# EAGLE schematic jphy_v1 (EAGLE 6.0)
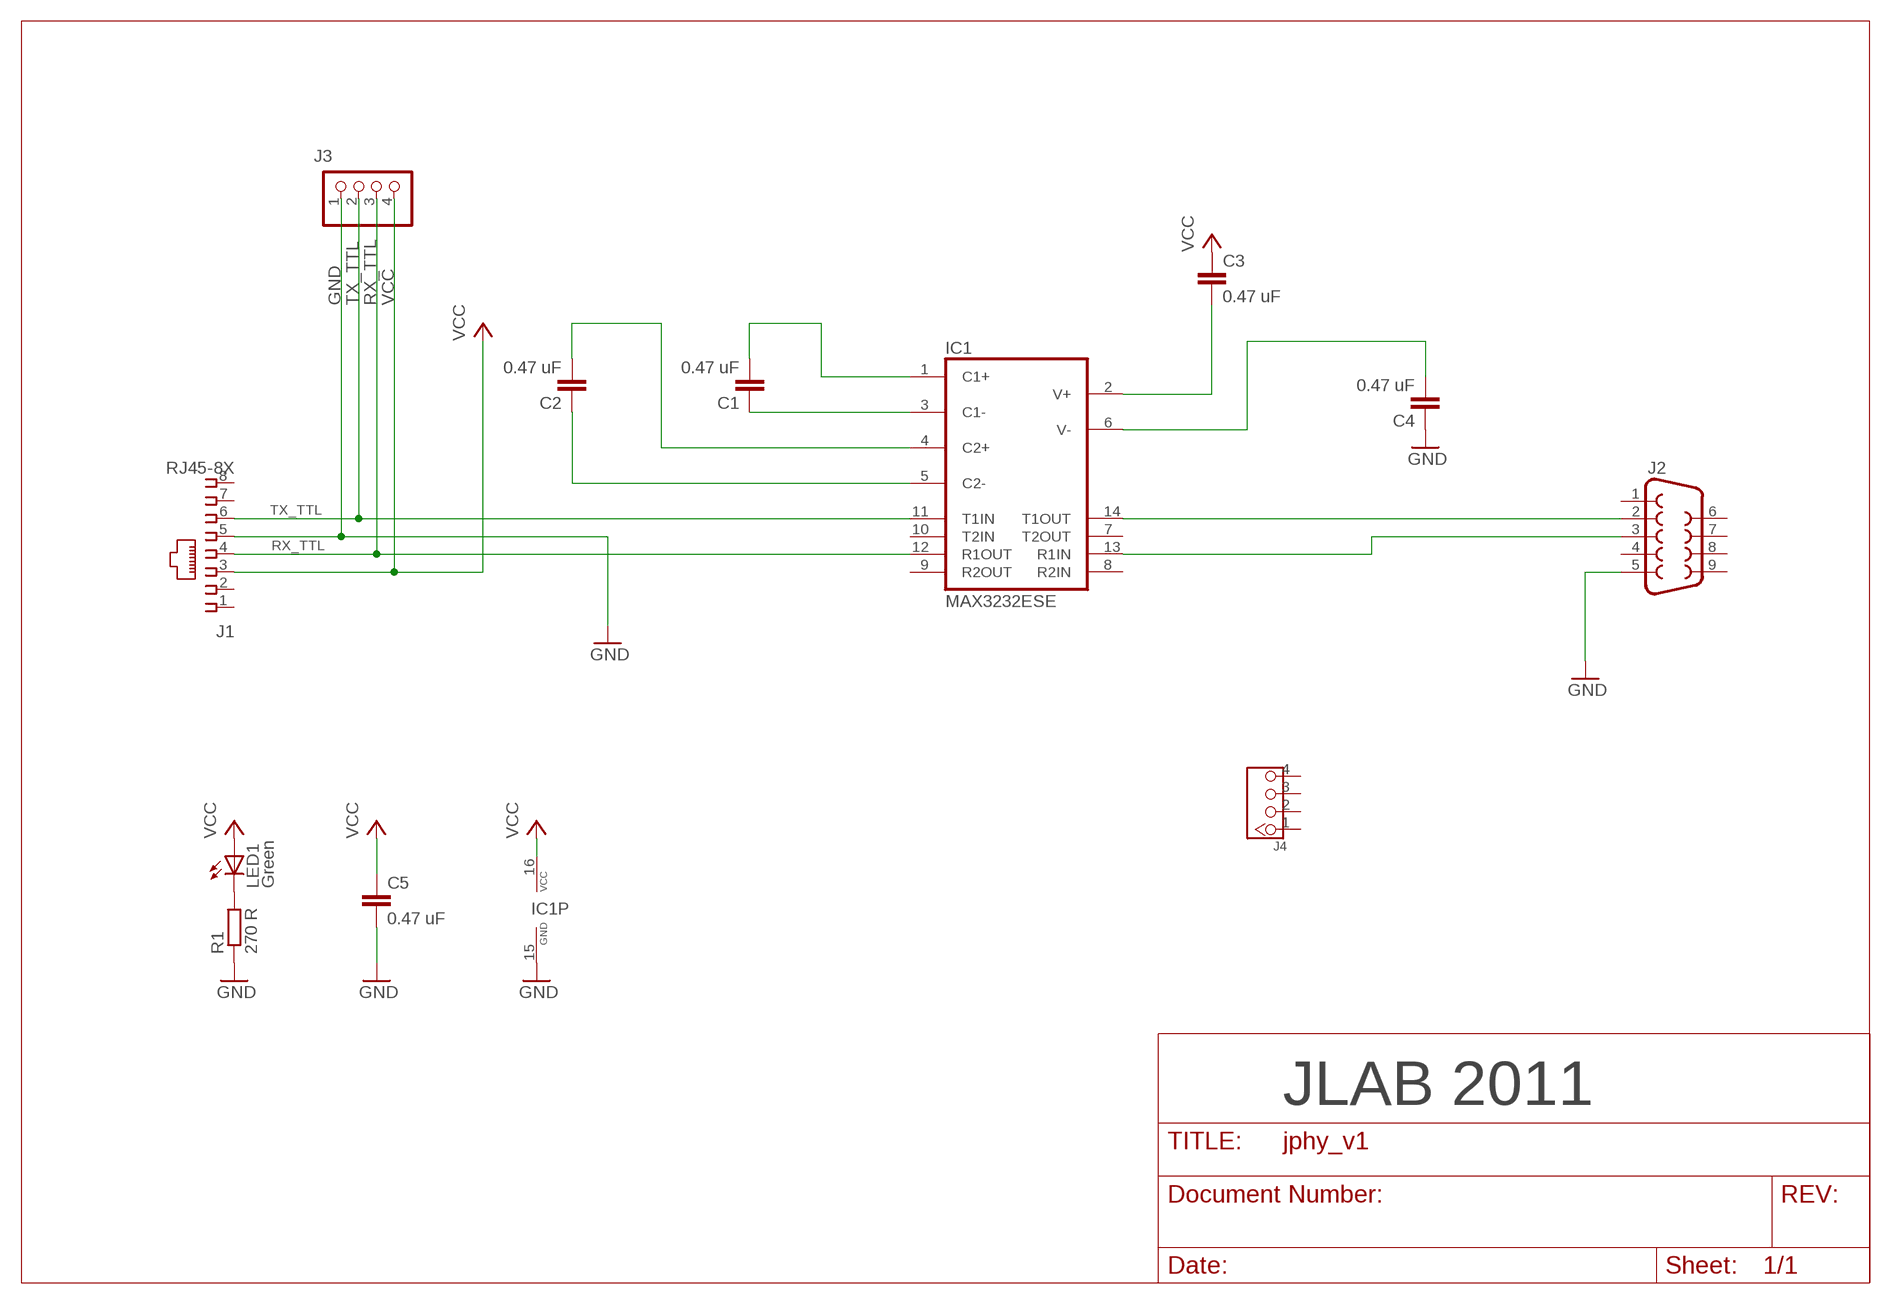
[diagram p0: schematic, sheet 1]

## Parts
C1  0.47 uF  C-EUC1206  [C1206]
C2  0.47 uF  C-EUC1206  [C1206]
C3  0.47 uF  C-EUC1206  [C1206]
C4  0.47 uF  C-EUC1206  [C1206]
C5  0.47 uF  C-EUC1206  [C1206]
IC1  MAX3232ESE  [SO16]
J1  RJ45-8X  [RJ45-NO-SHIELD]
J2  F09D  [F09D]
J3  PINHD-1X4  [1X04]
J4  HEADER-4P  [4P-2.54]
LED1  Green  LED3MM  [LED3MM]
R1  270 R  R-EU_0207/10  [0207/10]

## Nets
GND [power]: C4.1 C5.2 IC1.15(GND) J1.5 J2.5 J3.1 R1.1
N$1: LED1.K(C) R1.2
N$2: C3.2 IC1.2(V+)
N$3: C4.2 IC1.6(V-)
N$4: C1.1 IC1.3(C1-)
N$5: C1.2 IC1.1(C1+)
N$6: C2.1 IC1.5(C2-)
N$7: C2.2 IC1.4(C2+)
N$10: IC1.14(T1OUT) J2.2
N$11: IC1.13(R1IN) J2.3
RX_TTL: IC1.12(R1OUT) J1.4 J3.3
TX_TTL: IC1.11(T1IN) J1.6 J3.2
VCC [power]: C3.1 C5.1 IC1.16(VCC) J1.3 J3.4 LED1.A
Unconnected: IC1.7(T2OUT) IC1.8(R2IN) IC1.9(R2OUT) IC1.10(T2IN) J1.1 J1.2 J1.7 J1.8 J2.1 J2.4 J2.6 J2.7 J2.8 J2.9 J4.1 J4.2 J4.3 J4.4

## Notes on the sheet
- JLAB 2011

## Library data of the parts
C1-C5 = rcl:C-EU: CAPACITOR, European symbol
IC1 = maxim:MAX3232*: True RS-232 Transceivers 3.0V to 5.5V, Low-Power up to 1Mbps, Using Four 0.1µF External Capacitors Source: http://pdfserv.maxim-ic.com/en/ds/MAX3222-MAX3241.pdf; MF: MAXIM; MPN: MAX3232ESE; OC_FARNELL: 9725539; OC_NEWARK: 79C3880
J1 = jlab:RJ45: CORCOM Modular RJ Jacks No Shield Source: www.tycoelectronics.com .. ENG_DS_1654001_1099_RJ_L_0507.pdf; MPN: RJ45-8X; OC_FARNELL: unknown; OC_NEWARK: 16R6101
J2 = con-subd:F09: SUB-D; OC_FARNELL: unknown; OC_NEWARK: unknown
J3 = pinhead:PINHD-1X4: PIN HEADER
J4 = Connector:HEADER-4P
LED1 = led:LED: LED OSRAM: - CHIPLED LG R971, LG N971, LY N971, LG Q971, LY Q971, LO R971, LY R971 LH N974, LH R974 LS Q976, LO Q976, LY Q976 LO Q996 - Hyper CHIPLED LW Q18S LB Q993, LB Q99A, LB R99A - SideLED LS A670, LO A670, LY A670, LG A670, LP A670 LB A673, LV A673, LT A673, LW A673 LH A674 LY A675 LS A676, LA A676, LO A676, LY A676, LW A676 LS A679, LY A679, LG A679 - Hyper Micro SIDELED® LS Y876, LA Y876, LO Y876, LY Y876 LT Y87S - SmartLED LW L88C, LW L88S LB L89C, LB L89S, LG L890 LS L89K, LO L89K, LY L89K LS L896, LA L896, LO L896, LY L896 - TOPLED LS T670, LO T670, LY T670, LG T670, LP T670 LSG T670, LSP T670, LSY T670, LOP T670, LYG T670 LG T671, LOG T671, LSG T671 LB T673, LV T673, LT T673, LW T673 LH T674 LS T676, LA T676, LO T676, LY T676, LB T676, LH T676, LSB T676, LW T676 LB T67C, LV T67C, LT T67C, LS T67K, LO T67K, LY T67K, LW E67C LS E67B, LA E67B, LO E67B, LY E67B, LB E67C, LV E67C, LT E67C LW T67C LS T679, LY T679, LG T679 LS T770, LO T770, LY T770, LG T770, LP T770 LB T773, LV T773, LT T773, LW T773 LH T774 LS E675, LA E675, LY E675, LS T675 LS T776, LA T776, LO T776, LY T776, LB T776 LHGB T686 LT T68C, LB T68C - Hyper Mini TOPLED® LB M676 - Mini TOPLED Santana® LG M470 LS M47K, LO M47K, LY M47K Source: http://www.osram.convergy.de LUXEON: - LUMILED® LXK2-PW12-R00, LXK2-PW12-S00, LXK2-PW14-U00, LXK2-PW14-V00 LXK2-PM12-R00, LXK2-PM12-S00, LXK2-PM14-U00 LXK2-PE12-Q00, LXK2-PE12-R00, LXK2-PE12-S00, LXK2-PE14-T00, LXK2-PE14-U00 LXK2-PB12-K00, LXK2-PB12-L00, LXK2-PB12-M00, LXK2-PB14-N00, LXK2-PB14-P00, LXK2-PB14-Q00 LXK2-PR12-L00, LXK2-PR12-M00, LXK2-PR14-Q00, LXK2-PR14-R00 LXK2-PD12-Q00, LXK2-PD12-R00, LXK2-PD12-S00 LXK2-PH12-R00, LXK2-PH12-S00 LXK2-PL12-P00, LXK2-PL12-Q00, LXK2-PL12-R00 Source: www.luxeon.com KINGBRIGHT: KA-3528ASYC Source: www.kingbright.com
R1 = rcl:R-EU_: RESISTOR, European symbol

## Net classes
0 default: width 0.254 mm, clearance 0.254 mm
1 power: width 0.813 mm, clearance 0.406 mm